# EAGLE design msp432_breakout_ble113 (EAGLE 7.5.0)
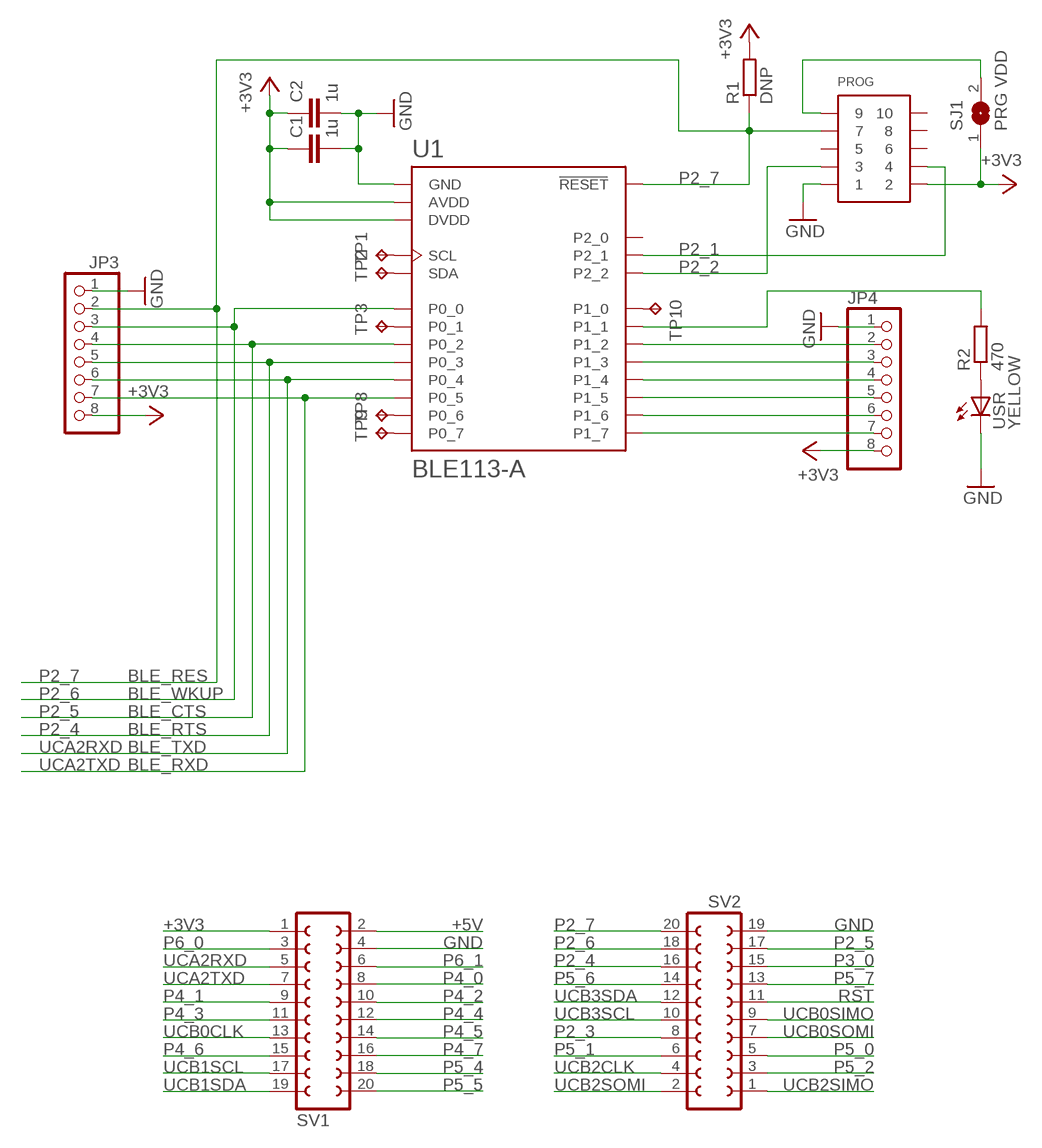
[diagram p0: schematic, sheet 1]

## Parts
C1  1u  C-EUC0603  [C0603]
C2  1u  C-EUC0603  [C0603]
JP3  PINHD-1X8  [1X08]
JP4  PINHD-1X8  [1X08]
PROG  CONN_5-2-FTSH-V  [FTSH-105-DV]
R1  DNP  R-EU_R0603  [R0603]
R2  470  R-EU_R0603  [R0603]
SJ1  PRG VDD  SJ  [SJ]
SV1  FE10-2  [FE10-2]
SV2  FE10-2  [FE10-2]
TP1  TPB1,27  [B1,27]
TP2  TPB1,27  [B1,27]
TP3  TPB1,27  [B1,27]
TP8  TPB1,27  [B1,27]
TP9  TPB1,27  [B1,27]
TP10  TPB1,27  [B1,27]
U1  BLE113-A  [BLE113-A]
USR  YELLOW  LEDCHIPLED_0805  [CHIPLED_0805]

## Nets
+3V3: C1.1 C2.1 JP3.8 JP4.8 PROG.2 R1.2 SJ1.1 SV1.1 U1.AVDD U1.DVDD
+5V: SV1.2
GND [power]: C1.2 C2.2 JP3.1 JP4.1 PROG.1 SV1.4 SV2.19 U1.GND U1.GND@2(GND) U1.GND@3(GND) U1.GND@4(GND) U1.GND@5(GND) U1.GND@6(GND) U1.GND@7(GND) U1.GND@8(GND) U1.GND@9(GND) U1.GND@10(GND) USR.C
N$1: TP3.TP U1.P0_1
N$2: R2.1 USR.A
N$3: JP4.6 U1.P1_6
N$4: JP4.7 U1.P1_7
N$5: R2.2 U1.P1_1
N$24: TP8.TP U1.P0_6
N$26: TP9.TP U1.P0_7
N$27: PROG.9 SJ1.2
N$28: TP1.TP U1.SCL
N$29: TP2.TP U1.SDA
P1_0: TP10.TP U1.P1_0
P1_2: JP4.2 U1.P1_2
P1_3: JP4.3 U1.P1_3
P1_4: JP4.4 U1.P1_4
P1_5: JP4.5 U1.P1_5
P2_1: PROG.4 U1.P2_1
P2_2: PROG.3 U1.P2_2
P2_3: SV2.8
P2_4: JP3.5 SV2.16 U1.P0_3
P2_5: JP3.4 SV2.17 U1.P0_2
P2_6: JP3.3 SV2.18 U1.P0_0
P2_7: JP3.2 PROG.7 R1.1 SV2.20 U1.RESET
P3_0: SV2.15
P4_0: SV1.8
P4_1: SV1.9
P4_2: SV1.10
P4_3: SV1.11
P4_4: SV1.12
P4_5: SV1.14
P4_6: SV1.15
P4_7: SV1.16
P5_0: SV2.5
P5_1: SV2.6
P5_2: SV2.3
P5_4: SV1.18
P5_5: SV1.20
P5_6: SV2.14
P5_7: SV2.13
P6_0: SV1.3
P6_1: SV1.6
RST: SV2.11
UCA2RXD: JP3.6 SV1.5 U1.P0_4
UCA2TXD: JP3.7 SV1.7 U1.P0_5
UCB0CLK: SV1.13
UCB0SIMO: SV2.9
UCB0SOMI: SV2.7
UCB1SCL: SV1.17
UCB1SDA: SV1.19
UCB2CLK: SV2.4
UCB2SIMO: SV2.1
UCB2SOMI: SV2.2
UCB3SCL: SV2.10
UCB3SDA: SV2.12
Unconnected: PROG.5 PROG.6 PROG.8 PROG.10 U1.P2_0

## Notes on the sheet
- BLE_RES
- BLE_WKUP
- BLE_CTS
- BLE_RTS
- BLE_TXD
- BLE_RXD

## Library data of the parts
C1 C2 = rcl:C-EU: CAPACITOR, European symbol
JP3 JP4 = pinhead:PINHD-1X8: PIN HEADER
PROG = pel_misc:CONN_5-2
R1 R2 = rcl:R-EU_: RESISTOR, European symbol
SJ1 = jumper:SJ: SMD solder JUMPER
SV1 SV2 = con-lsta:FE10-2: FEMALE HEADER; OC_FARNELL: unknown; OC_NEWARK: unknown
TP1-TP3 TP8-TP10 = testpad:TP: Test pad
U1 = sf-bluegiga:BLE113: Bluetooth Low Energy single-mode module - Bluetooth 4.0 (CC2541). BLE113-A variant has an on-module ceramic chip antenna. BLE113-A variant includes keepout/restrict area. Antenna edge of the module should be flush up against the edge of the PCB. See datasheet for variant layout details. The BLE113 is a Bluetooth Smart module targeted for small and low-power sensors and accessories. It integrates all features required for a Bluetooth Smart application, including Bluetooth radio, software stack, and GATT-based profiles. The BLE113 Bluetooth Smart module can also host end-user applications, which means no external micro controller is required in size or price constrained devices. Moreover, it has flexible hardware interfaces to connect to different peripherals and sensors and can be powered directly from a standard 3V coin cell battery or a pair of AAA batteries. In the lowest power sleep mode it merely consumes 500 nA and will wake up within a few hundred microseconds. The BLE113 Bluetooth Smart module conusmer approximately 30% less power and is smaller than the BLE112 Bluetooth Smart Module. http://www.bluegiga.com/en-US/products/bluetooth-4.0-modules/ble113-bluetooth--smart-module https://github.com/jrowberg/sf-oshw Last updated 2014-01-04 by Jeff Rowberg <jeff@rowberg.net>; ANTENNA: On-module ceramic chip antenna
USR = led:LED: LED OSRAM: - CHIPLED LG R971, LG N971, LY N971, LG Q971, LY Q971, LO R971, LY R971 LH N974, LH R974 LS Q976, LO Q976, LY Q976 LO Q996 - Hyper CHIPLED LW Q18S LB Q993, LB Q99A, LB R99A - SideLED LS A670, LO A670, LY A670, LG A670, LP A670 LB A673, LV A673, LT A673, LW A673 LH A674 LY A675 LS A676, LA A676, LO A676, LY A676, LW A676 LS A679, LY A679, LG A679 - Hyper Micro SIDELED® LS Y876, LA Y876, LO Y876, LY Y876 LT Y87S - SmartLED LW L88C, LW L88S LB L89C, LB L89S, LG L890 LS L89K, LO L89K, LY L89K LS L896, LA L896, LO L896, LY L896 - TOPLED LS T670, LO T670, LY T670, LG T670, LP T670 LSG T670, LSP T670, LSY T670, LOP T670, LYG T670 LG T671, LOG T671, LSG T671 LB T673, LV T673, LT T673, LW T673 LH T674 LS T676, LA T676, LO T676, LY T676, LB T676, LH T676, LSB T676, LW T676 LB T67C, LV T67C, LT T67C, LS T67K, LO T67K, LY T67K, LW E67C LS E67B, LA E67B, LO E67B, LY E67B, LB E67C, LV E67C, LT E67C LW T67C LS T679, LY T679, LG T679 LS T770, LO T770, LY T770, LG T770, LP T770 LB T773, LV T773, LT T773, LW T773 LH T774 LS E675, LA E675, LY E675, LS T675 LS T776, LA T776, LO T776, LY T776, LB T776 LHGB T686 LT T68C, LB T68C - Hyper Mini TOPLED® LB M676 - Mini TOPLED Santana® LG M470 LS M47K, LO M47K, LY M47K Source: http://www.osram.convergy.de LUXEON: - LUMILED® LXK2-PW12-R00, LXK2-PW12-S00, LXK2-PW14-U00, LXK2-PW14-V00 LXK2-PM12-R00, LXK2-PM12-S00, LXK2-PM14-U00 LXK2-PE12-Q00, LXK2-PE12-R00, LXK2-PE12-S00, LXK2-PE14-T00, LXK2-PE14-U00 LXK2-PB12-K00, LXK2-PB12-L00, LXK2-PB12-M00, LXK2-PB14-N00, LXK2-PB14-P00, LXK2-PB14-Q00 LXK2-PR12-L00, LXK2-PR12-M00, LXK2-PR14-Q00, LXK2-PR14-R00 LXK2-PD12-Q00, LXK2-PD12-R00, LXK2-PD12-S00 LXK2-PH12-R00, LXK2-PH12-S00 LXK2-PL12-P00, LXK2-PL12-Q00, LXK2-PL12-R00 Source: www.luxeon.com KINGBRIGHT: KA-3528ASYC Source: www.kingbright.com

## Net classes
1 power: width 0.254 mm, drill 0.33 mm, clearance 0.152 mm

## Board
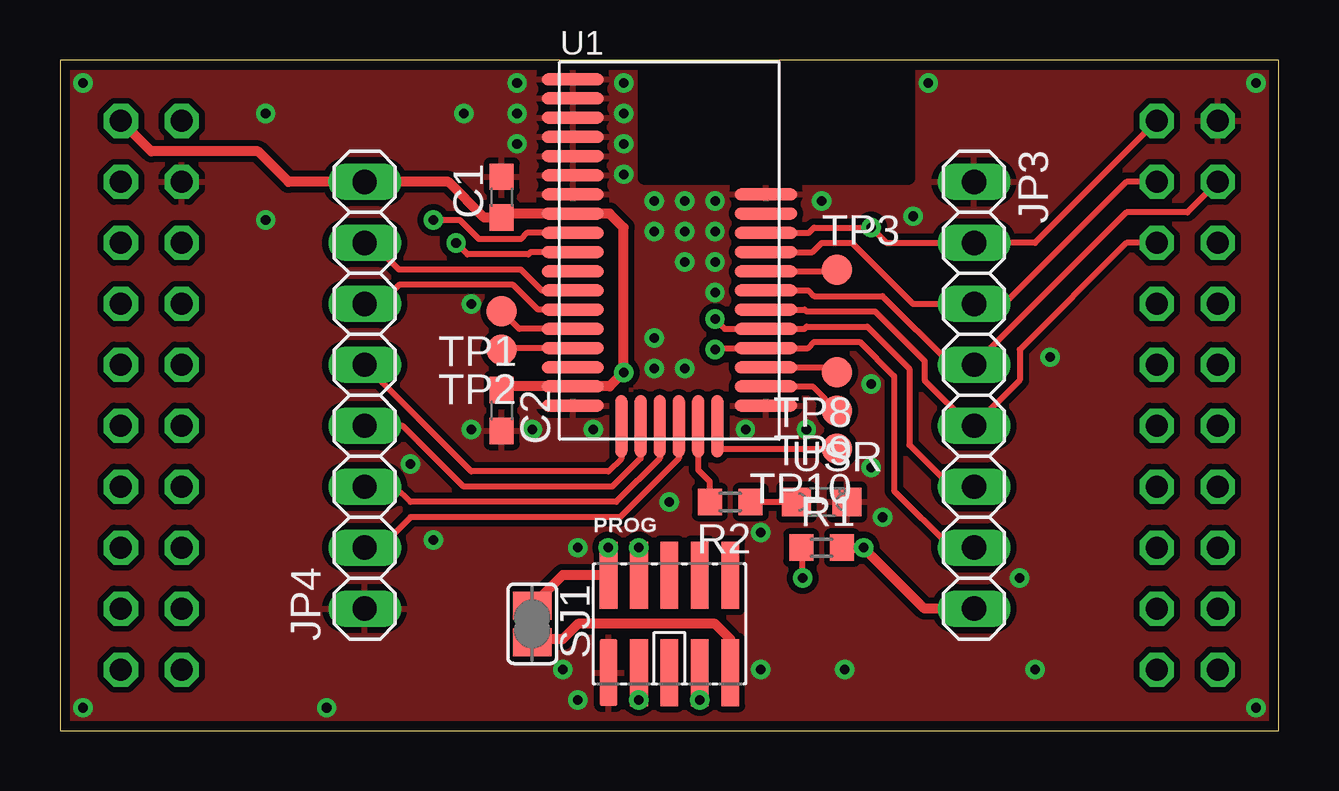
[diagram p1: board, top side]
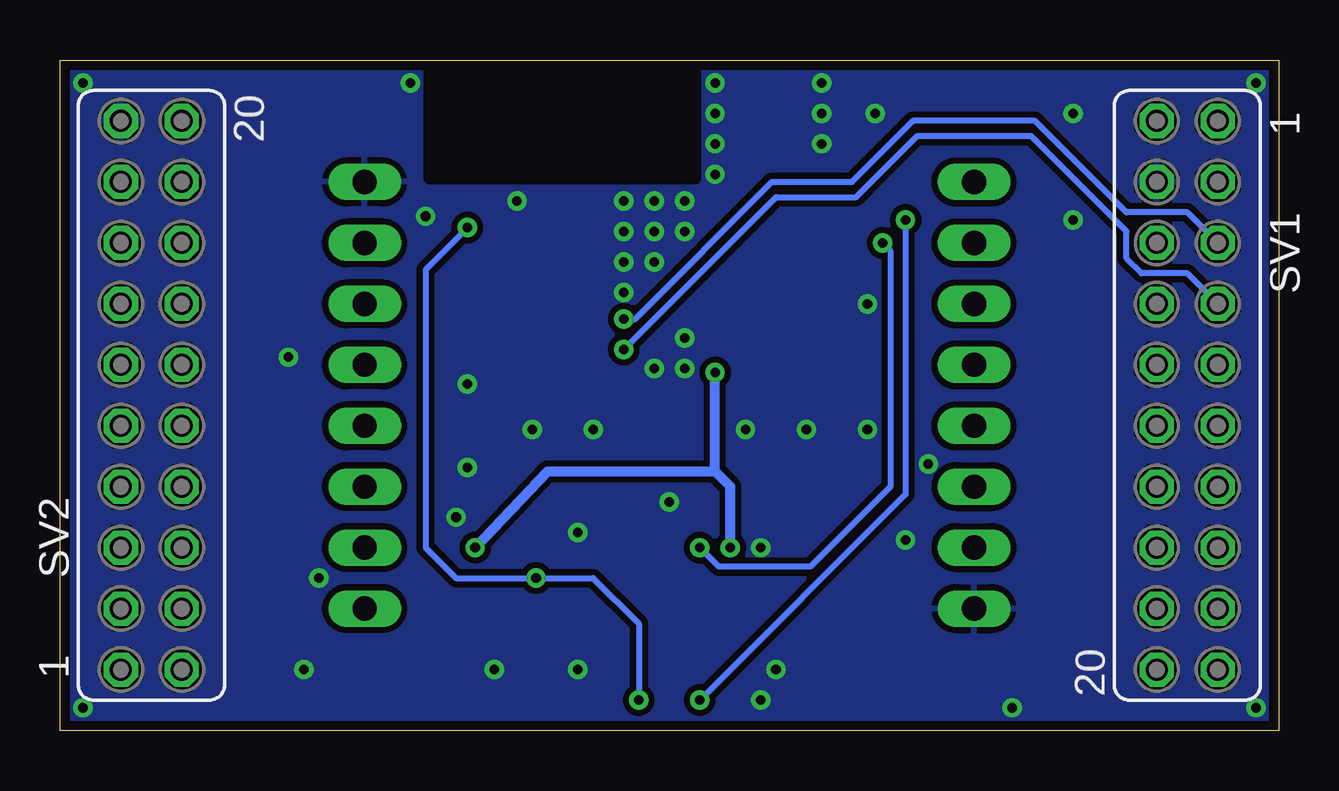
[diagram p2: board, bottom side, seen from below]

Size 50.8 x 27.94 mm. Coordinates in mm from the lower left corner, seen from the top.
Outline: 0,27.94 0,0 50.8,0 50.8,27.94 0,27.94
Copper layers (1*16): Top 0.035mm / dielectric 1.5mm / Bottom 0.035mm
Design rules "default *": minimum track width 10mil, minimum drill 0.4mm, track to track 8mil, track to pad 8mil, pad to pad 8mil, via to via 8mil, smd to smd 0mil, copper to edge 16mil, drill to drill 8mil, minimum pad ring 10mil, minimum via ring 8mil, stop-mask expansion 4mil, vias tented up to drill 0.4mm, thermal gap 10mil

### Footprints (pad centres in the part's own frame; a part is rotated, then mirrored left to right if it is on the bottom)
C0603 = smd 1.1 x 1: 1 -0.85,0; 2 0.85,0
1X08 = drill 1.016 long: 1 -8.89,0; 2 -6.35,0; 3 -3.81,0; 4 -1.27,0; 5 1.27,0; 6 3.81,0; 7 6.35,0; 8 8.89,0
FTSH-105-DV = smd 0.74 x 2.8: 1 -2.54,-2.03; 2 -2.54,2.03; 3 -1.27,-2.03; 4 -1.27,2.03; 5 0,-2.03; 6 0,2.03; 7 1.27,-2.03; 8 1.27,2.03; 9 2.54,-2.03; 10 2.54,2.03
R0603 = smd 1 x 1.1: 1 -0.85,0; 2 0.85,0
SJ = smd 1.168 x 1.6: 1 -0.762,0; 2 0.762,0
FE10-2 = drill 0.914 octagon: 1 -11.43,1.27; 2 -11.43,-1.27; 3 -8.89,1.27; 4 -8.89,-1.27; 5 -6.35,1.27; 6 -6.35,-1.27; 7 -3.81,1.27; 8 -3.81,-1.27; 9 -1.27,1.27; 10 -1.27,-1.27; 11 1.27,1.27; 12 1.27,-1.27; 13 3.81,1.27; 14 3.81,-1.27; 15 6.35,1.27; 16 6.35,-1.27; 17 8.89,1.27; 18 8.89,-1.27; 19 11.43,1.27; 20 11.43,-1.27
B1,27 = smd 1.27 x 1.27: TP 0,0
BLE113-A = smd 2.6 x 0.5: AVDD -4.025,1.538; DVDD -4.025,-5.662; GND -4.025,7.138; GND@2 -4.025,6.338; GND@3 -4.025,5.537; GND@4 -4.025,4.737; GND@5 -4.025,3.938; GND@6 -4.025,3.138; GND@7 -4.025,2.337; GND@8 -4.025,-6.463; GND@9 4.025,-6.463; GND@10 4.025,2.337; NC -4.025,-4.862; NC@2 4.025,1.538; P0_0 4.025,-0.062; P0_1 4.025,-0.863; P0_2 4.025,-1.663; P0_3 4.025,-2.462; P0_4 4.025,-3.263; P0_5 4.025,-4.062; P0_6 4.025,-4.862; P0_7 4.025,-5.662; P1_6 -4.025,-2.462; P1_7 -4.025,-1.663; P2_0 -4.025,-0.863; P2_1 -4.025,-0.062; P2_2 -4.025,0.738; RESET 4.025,0.738; SCL -4.025,-3.263; SDA -4.025,-4.062 | smd 0.5 x 2.6: P1_0 2,-7.312; P1_1 1.2,-7.312; P1_2 0.4,-7.312; P1_3 -0.4,-7.312; P1_4 -1.2,-7.312; P1_5 -2,-7.312
CHIPLED_0805 = smd 1.2 x 1.2: A 0,-1.05; C 0,1.05

### Placement (x,y rotation side)
C1  18.41,22.23 90 top
C2  18.41,13.34 270 top
JP3  38.1,13.97 270 top
JP4  12.7,13.97 90 top
PROG  25.4,4.45 0 top
R1  31.75,7.62 0 top
R2  27.94,9.53 180 top
SJ1  19.68,4.45 270 top
SV1  3.81,13.97 270 bottom
SV2  46.99,13.97 90 bottom
TP1  18.41,17.46 180 top
TP2  18.41,15.88 180 top
TP3  32.38,19.21 0 top
TP8  32.38,14.92 180 top
TP9  32.38,13.34 180 top
TP10  32.38,11.75 180 top
U1  25.4,20 0 top
USR  31.75,9.53 270 top

### Tracks (layer width: path | path; a pad name or v marks a point on that pad's centre or on a via)
+3V3  (via drill 0.4)
  Top 0.406: C2.1 18.57,14.34 U1.DVDD 22.91,14.34 v23.5,14.92 23.5,20.95 22.91,21.54 U1.AVDD 18.58,21.54 C1.1 17.68,21.38 16.19,22.86 JP4.8 9.53,22.86 8.26,24.13 3.81,24.13 SV1.1 | v22.86,7.62 PROG.2 20.95,6.47 SJ1.1 | JP3.8 36.04,5.08 v33.5,7.62 R1.2
  Bottom 0.406: v22.86,7.62 22.86,10.16 23.5,10.79 | 23.5,10.79 v23.5,14.92 | v33.5,7.62 30.48,10.79 23.5,10.79
GND  (via drill 0.4)
  other vias: 31.11,12.54 28.57,12.54 22.23,12.54 19.68,12.54 23.5,26.99 23.5,25.72 23.5,24.45 23.5,23.18 19.05,26.99 19.05,25.72 19.05,24.45 31.75,22.07 27.3,22.07 26.04,22.07 24.77,22.07 0.95,26.99 49.85,26.99 49.85,0.95 0.95,0.95 8.57,25.72 8.57,21.27 16.83,25.72 17.14,17.78 17.14,12.54 14.61,11.11 21.59,7.62 25.4,9.53 29.21,8.26 29.21,2.54 32.7,2.54 20.95,2.54 21.59,1.27 11.11,0.95 27.3,20.8 27.3,19.53 27.3,18.26 26.04,19.53 26.04,20.8 24.77,20.8 24.77,15.08 26.04,15.08 24.77,16.35 35.56,21.43 36.2,26.99 41.27,15.56 34.29,8.89 40.01,6.35 40.64,2.54 15.56,7.94 33.81,10.95 33.81,14.45
  pour Top (isolate 0.254): 0,27.94 50.8,27.94 50.8,0 0,0
  pour Bottom (isolate 0.254): 0,27.94 50.8,27.94 50.8,0 0,0
N$1
  Top 0.254: 29.12,19.14 29.21,19.14 U1.P0_1 32.31,19.14 TP3.TP
N$2
  Top 0.254: R2.1 USR.A
N$3
  Top 0.254: 21.68,17.54 21.59,17.54 U1.P1_6 19.93,17.54 18.89,18.57 14.13,18.57 13.34,17.78 JP4.6
N$4
  Top 0.254: 21.68,18.34 21.59,18.34 U1.P1_7 20.08,18.34 19.21,19.21 14.13,19.21 13.02,20.32 JP4.7
N$5
  Top 0.254: R2.2 27.09,10.38 26.6,10.87 U1.P1_1 26.6,12.99
N$24
  Top 0.254: 29.12,15.14 29.21,15.14 U1.P0_6 32.17,15.14 TP8.TP
N$26
  Top 0.254: TP9.TP 31.38,14.34 U1.P0_7 29.12,14.34
N$27
  Top 0.406: PROG.9 27.94,3.81 27.3,4.45 21.59,4.45 20.95,3.81 19.81,3.81 SJ1.2
N$28
  Top 0.254: 21.68,16.74 21.59,16.74 U1.SCL 19.14,16.74 TP1.TP
N$29
  Top 0.254: 21.68,15.94 21.59,15.94 U1.SDA 18.41,15.94 TP2.TP
P1_0
  Top 0.254: 27.4,12.99 U1.P1_0 27.4,11.97 27.62,11.75 TP10.TP
P1_2
  Top 0.254: 25.8,12.99 U1.P1_2 25.8,11.35 23.34,8.89 14.61,8.89 13.34,7.62 JP4.2
P1_3
  Top 0.254: 25,12.99 U1.P1_3 25,11.35 23.18,9.53 14.61,9.53 13.97,10.16 JP4.3
P1_4
  Top 0.254: 24.2,12.99 U1.P1_4 24.2,11.34 23.02,10.16 16.83,10.16 14.29,12.7 JP4.4
P1_5
  Top 0.254: 23.4,12.99 U1.P1_5 23.4,11.34 22.86,10.79 17.14,10.79 JP4.5
P2_1  (via drill 0.4)
  Top 0.254: v16.51,20.32 16.99,19.84 19.53,19.84 19.62,19.94 U1.P2_1 21.59,19.94 21.68,19.94 | v24.13,7.62 PROG.4
  Bottom 0.254: v16.51,20.32 16.19,20 16.19,10.16 19.53,6.83 23.34,6.83 v24.13,7.62
P2_2  (via drill 0.4)
  Top 0.254: 21.68,20.74 21.59,20.74 U1.P2_2 19.47,20.74 19.21,20.48 17.46,20.48 16.67,21.27 v15.56,21.27 | v24.13,1.27 PROG.3
  Bottom 0.254: v15.56,21.27 15.56,9.84 v24.13,1.27
P2_4
  Top 0.254: SV2.16 44.45,20.32 40.01,15.88 40.01,14.61 JP3.5 37.94,12.7 36.04,14.61 36.04,15.4 33.97,17.46 31.11,17.46 31.04,17.54 U1.P0_3 29.12,17.54
P2_5
  Top 0.254: SV2.17 46.99,21.59 44.45,21.59 JP3.4 37.15,15.24 34.29,18.1 31.43,18.1 31.19,18.34 U1.P0_2 29.12,18.34
P2_6
  Top 0.254: SV2.18 44.45,22.86 39.37,17.78 JP3.3 35.56,17.78 33.02,20.32 31.75,20.32 31.37,19.94 U1.P0_0 29.12,19.94
P2_7  (via drill 0.4)
  Top 0.254: SV2.20 40.64,20.32 JP3.2 34.45,20.32 v33.81,20.95 31.43,20.95 31.21,20.74 U1.RESET 29.12,20.74 | PROG.7 v26.67,1.27 | v30.96,6.35 30.96,7.56 R1.1
  Bottom 0.254: v33.81,20.95 35.56,19.21 35.56,7.62 34.29,6.35 v30.96,6.35 28.57,6.35 26.67,4.45 v26.67,1.27
UCA2RXD  (via drill 0.4)
  Top 0.254: JP3.6 37.15,10.16 35.4,11.91 35.4,15.08 33.66,16.83 31.11,16.83 31.02,16.74 U1.P0_4 27.71,16.74 v27.3,17.14
  Bottom 0.254: v27.3,17.14 26.83,17.14 21.11,22.86 17.78,22.86 15.24,25.4 10.16,25.4 6.35,21.59 3.81,21.59 SV1.5
UCA2TXD  (via drill 0.4)
  Top 0.254: JP3.7 37.15,7.62 34.77,10 34.77,14.76 33.34,16.19 31.43,16.19 31.18,15.94 U1.P0_5 27.37,15.94 v27.3,15.88
  Bottom 0.254: v27.3,15.88 20.95,22.23 17.62,22.23 15.08,24.77 10.32,24.77 6.35,20.8 6.35,19.68 5.71,19.05 3.81,19.05 SV1.7

### Text on the board
potisk: BLE113 | v1/ | breakout | 2016 | 3V3 | GND | P1.7 | RES | P1.6 | P0.0 | P1.5 | P0.2 | P1.4 | P0.3 | P1.3 | P0.4 | P1.2 | P0.5 | GND | 3V3 | for MSP432 | DREL